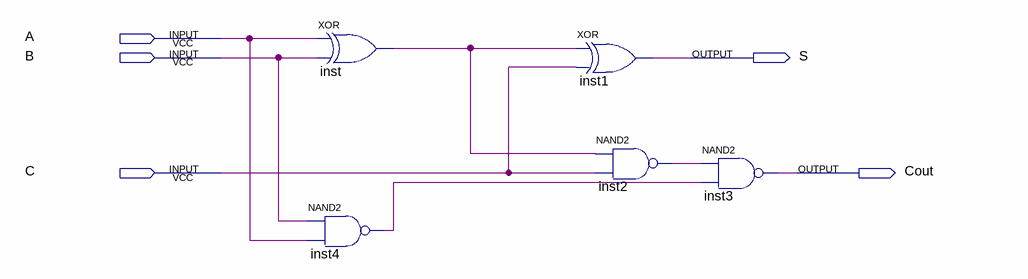
[diagram p0: schematic sheet]
// Quartus schematic PreLab2.bdf as structural Verilog: 5 symbols, 5 pins
module PreLab2 (
  input  A,
  input  B,
  input  C,
  output S,
  output Cout
);

  wire inst2_out, inst4_out, inst_out;

  xor inst (inst_out, A, B);
  nand inst4 (inst4_out, B, A);
  xor inst1 (S, inst_out, C);
  nand inst2 (inst2_out, inst_out, C);
  nand inst3 (Cout, inst2_out, inst4_out);
endmodule
